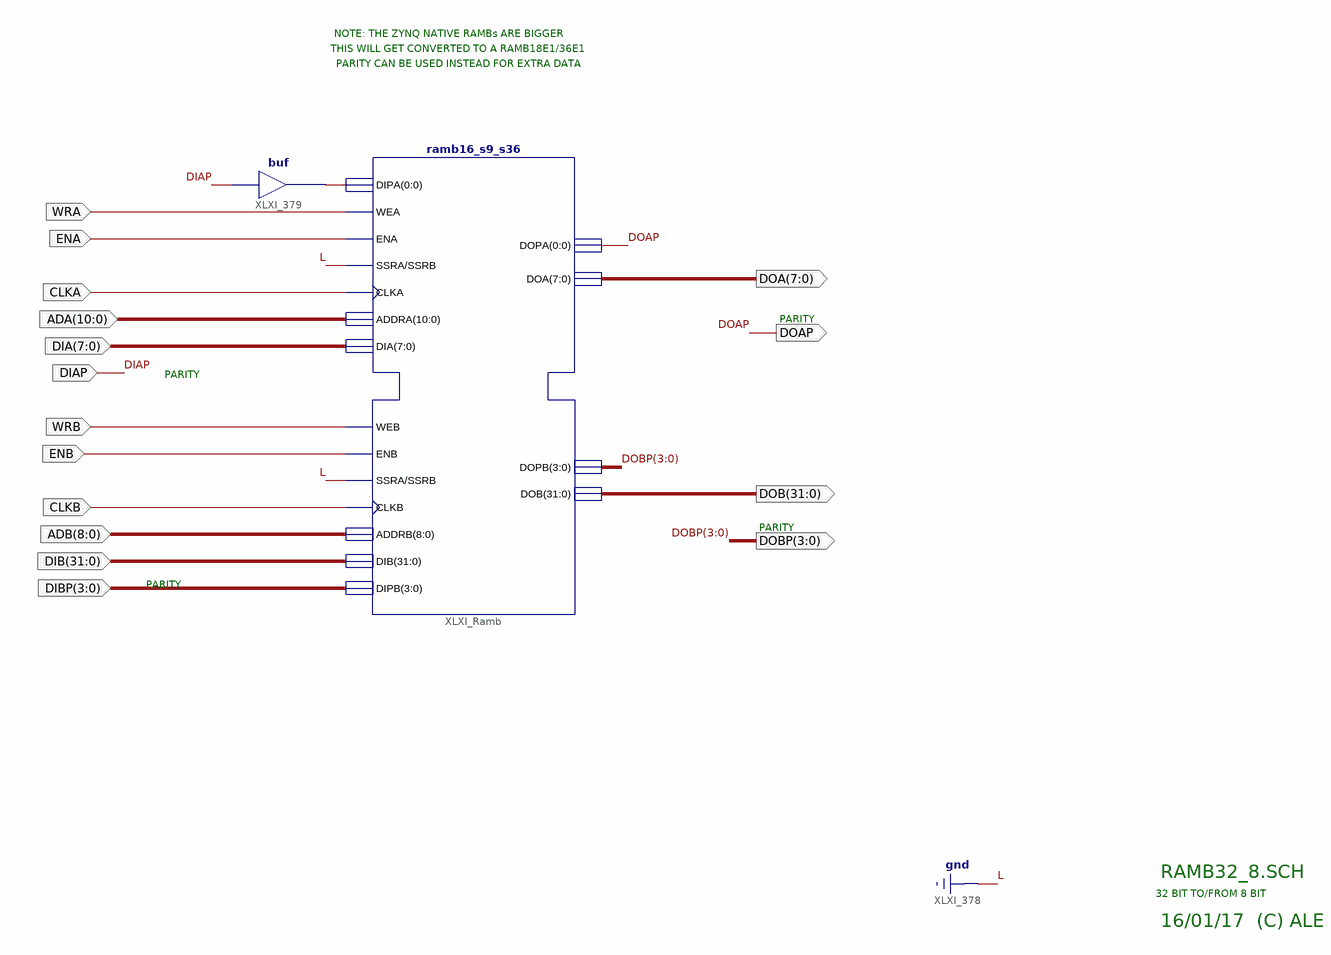
[diagram p0: schematic sheet 1]
// Xilinx ISE schematic Ramb32_8.sch (zynq) as structural Verilog: 2 symbols, 16 ports
module Ramb32_8 (
  input  CLKA,
  input  [10:0] ADA,
  input  [7:0] DIA,
  input  CLKB,
  input  [8:0] ADB,
  input  [31:0] DIB,
  input  ENA,
  input  WRA,
  input  WRB,
  input  ENB,
  input  DIAP,
  input  [3:0] DIBP,
  output [31:0] DOB,
  output [7:0] DOA,
  output DOAP,
  output [3:0] DOBP
);

  wire [0:0] XLXN_14;

  ramb16_s9_s36 XLXI_Ramb (
    .ADDRA(ADA), .ADDRB(ADB), .CLKA(CLKA), .CLKB(CLKB), .DIA(DIA), .DIB(DIB), .DIPA(XLXN_14[0]), .DIPB(DIBP),
    .ENA(ENA), .ENB(ENB), .SSRA(1'b0), .SSRB(1'b0), .WEA(WRA), .WEB(WRB), .DOA(DOA), .DOB(DOB), .DOPA(DOAP),
    .DOPB(DOBP));
  buf XLXI_379 (XLXN_14[0], DIAP);

  // Notes on the sheet:
  //   NOTE: THE ZYNQ NATIVE RAMBs ARE BIGGER
  //   THIS WILL GET CONVERTED TO A RAMB18E1/36E1
  //   PARITY CAN BE USED INSTEAD FOR EXTRA DATA
  //   PARITY
  //   PARITY
  //   PARITY
  //   PARITY
  //   RAMB32_8.SCH
  //   32 BIT TO/FROM 8 BIT
  //   16/01/17  (C) ALE
endmodule
